# Altium schematic sheet LINK2_LPC4322 PERIPH-DEBUG.SchDoc
size A3; CheckedBy: José Ogando; Engineer: Eduardo Teofilo; Revision: A2; SheetNumber: 8; SheetTotal: 8
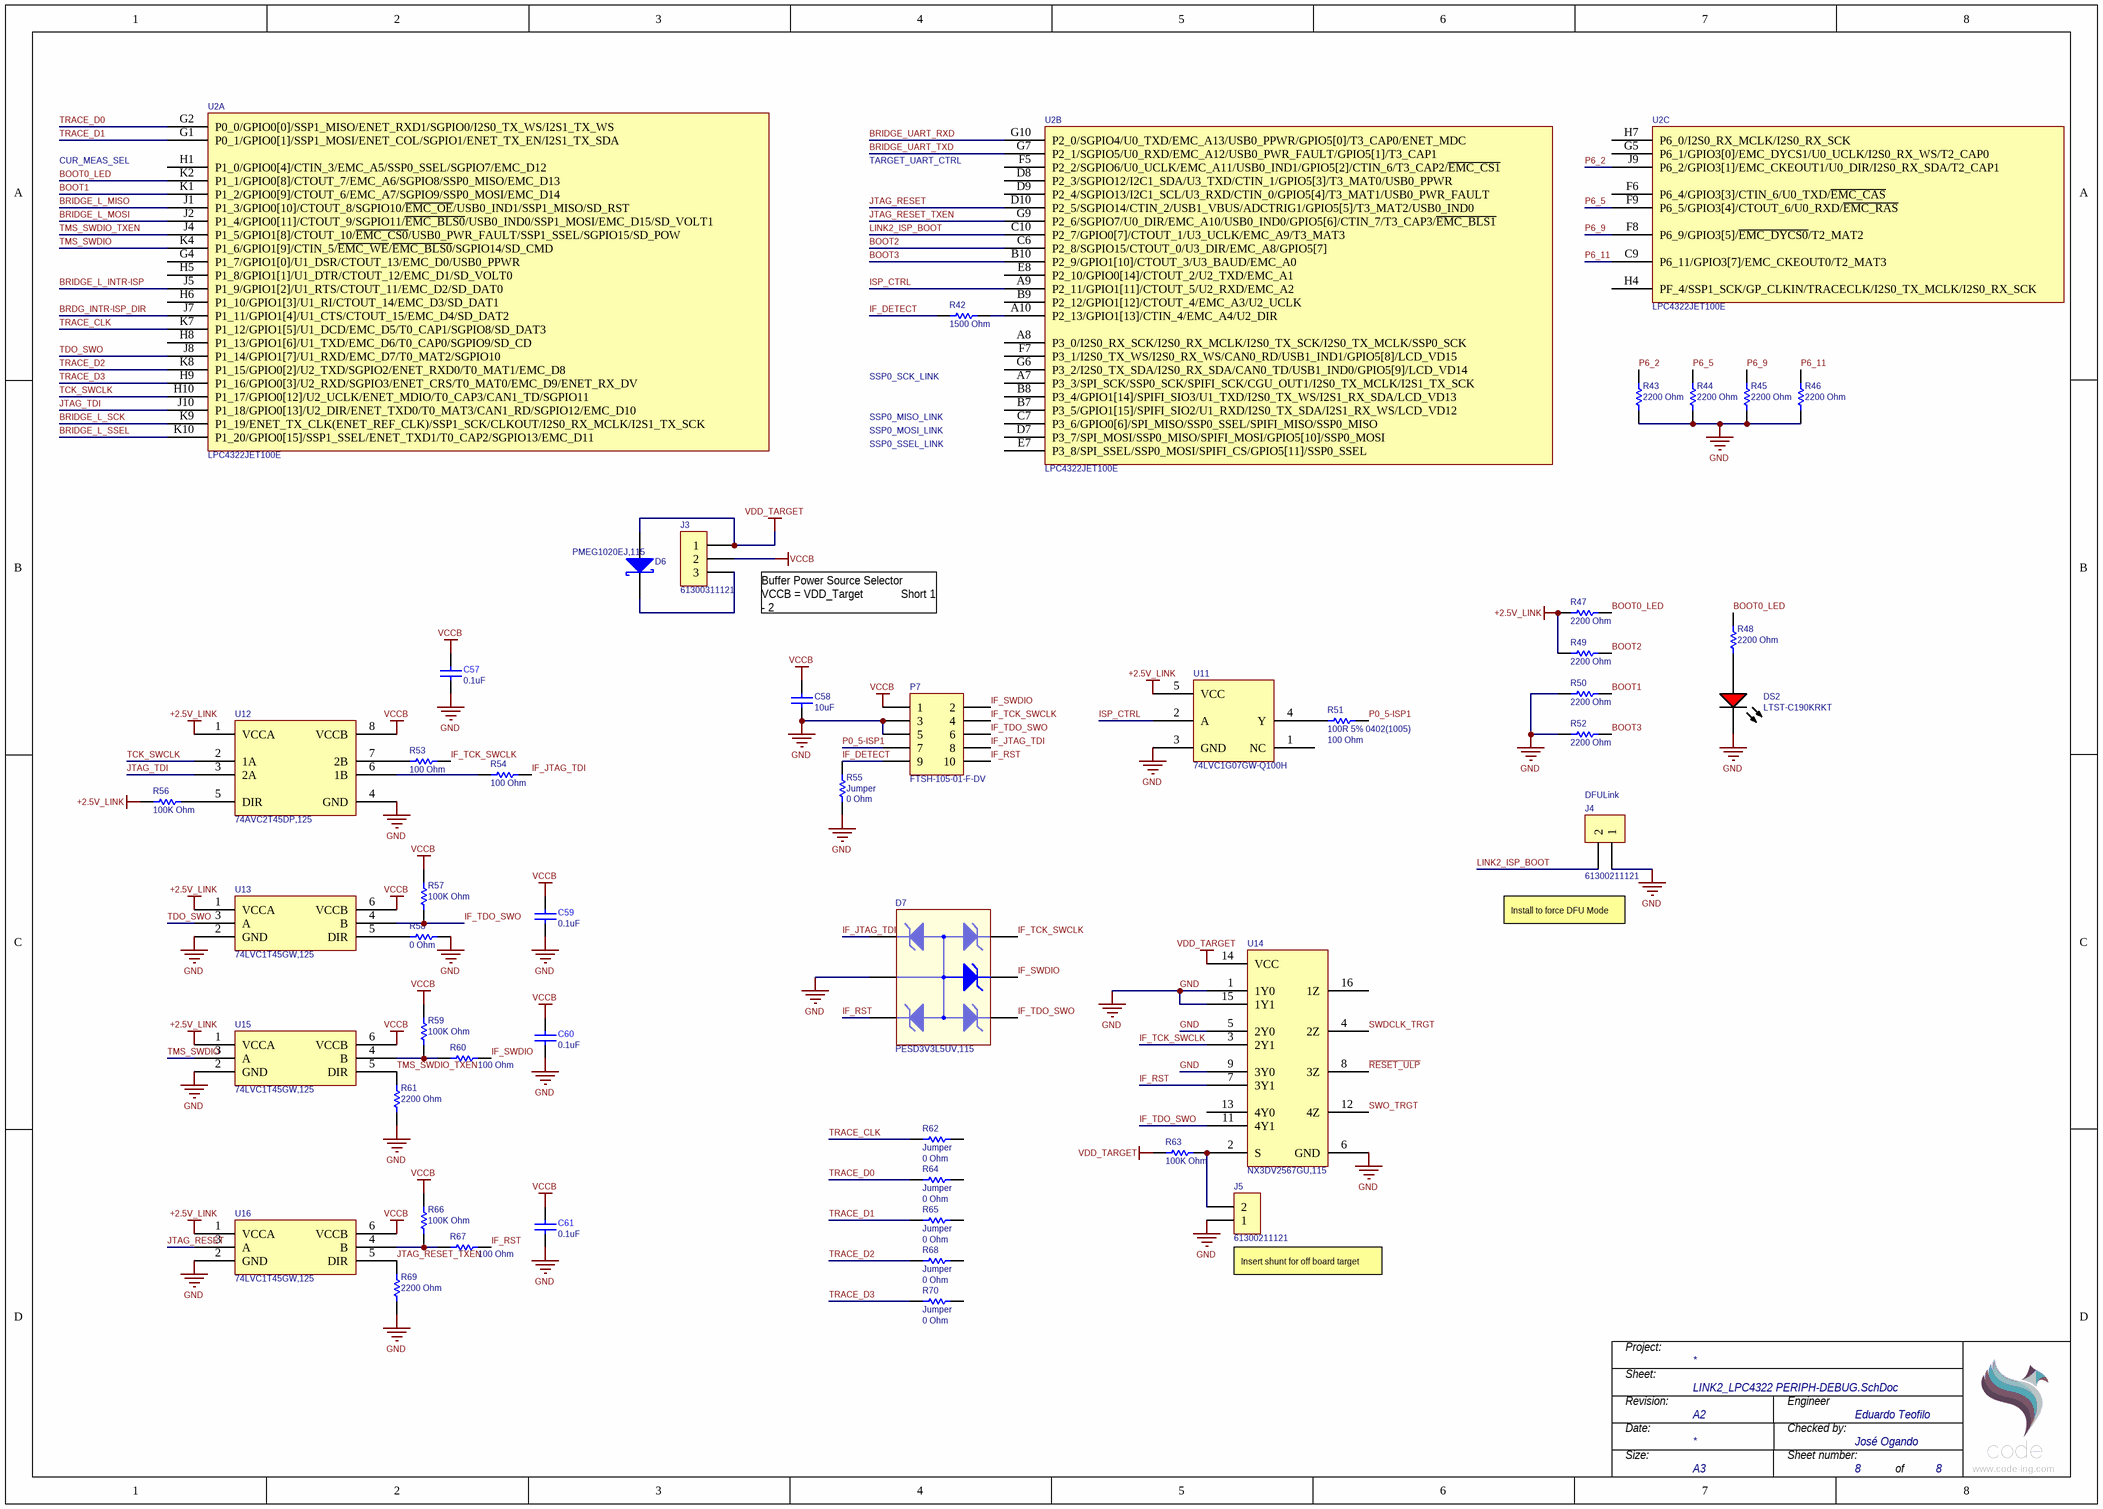
[diagram p0: LINK2_LPC4322 PERIPH-DEBUG.SchDoc]

## Parts
C57  value 0.1uF  [CAPC1005]  (hidden comment: CC0402KRX7R7BB104)
C58  value 10uF  [CAPC0805(2012)145_L]  (hidden comment: CAP 10uF 10V 0805(2012))
C59  value 0.1uF  [CAPC1005]  (hidden comment: CC0402KRX7R7BB104)
C60  value 0.1uF  [CAPC1005]  (hidden comment: CC0402KRX7R7BB104)
C61  value 0.1uF  [CAPC1005]  (hidden comment: CC0402KRX7R7BB104)
D6  PMEG1020EJ,115  [SOD-323F, SC90]
D7  PESD3V3L5UV,115  [SOT-666]
DS2  LTST-C190KRKT  [LTST-C191KRKT_V]
J3  61300311121  [61300311121]
J4  61300211121  [61300211121]
J5  61300211121  [61300211121]
P7  FTSH-105-01-F-DV  [FTSH-105-01-L-DV-K]
R42  value 1500 Ohm  [RESC0402(1005)_L]  (hidden comment: 1K5 1% 0402(1005))
R43  value 2200 Ohm  [RESC0402(1005)_L]  (hidden comment: 2K2 1% 0402(1005))
R44  value 2200 Ohm  [RESC0402(1005)_L]  (hidden comment: 2K2 1% 0402(1005))
R45  value 2200 Ohm  [RESC0402(1005)_L]  (hidden comment: 2K2 1% 0402(1005))
R46  value 2200 Ohm  [RESC0402(1005)_L]  (hidden comment: 2K2 1% 0402(1005))
R47  value 2200 Ohm  [RESC0402(1005)_L]  (hidden comment: 2K2 1% 0402(1005))
R48  value 2200 Ohm  [RESC0402(1005)_L]  (hidden comment: 2K2 1% 0402(1005))
R49  value 2200 Ohm  [RESC0402(1005)_L]  (hidden comment: 2K2 1% 0402(1005))
R50  value 2200 Ohm  [RESC0402(1005)_L]  (hidden comment: 2K2 1% 0402(1005))
R51  100R 5% 0402(1005)  value 100 Ohm  [RESC0402(1005)_L]
R52  value 2200 Ohm  [RESC0402(1005)_L]  (hidden comment: 2K2 1% 0402(1005))
R53  value 100 Ohm  [RESC0402(1005)_L]  (hidden comment: 100R 5% 0402(1005))
R54  value 100 Ohm  [RESC0402(1005)_L]  (hidden comment: 100R 5% 0402(1005))
R55  Jumper  value 0 Ohm  [RESC0402(1005)_L]
R56  value 100K Ohm  [RESC1005X40X25LL05T05]  (hidden comment: ERJ-2RKF1003X)
R57  value 100K Ohm  [RESC1005X40X25LL05T05]  (hidden comment: ERJ-2RKF1003X)
R58  value 0 Ohm  [RESC0402(1005)_L]  (hidden comment: Jumper 0402(1005))
R59  value 100K Ohm  [RESC1005X40X25LL05T05]  (hidden comment: ERJ-2RKF1003X)
R60  value 100 Ohm  [RESC0402(1005)_L]  (hidden comment: 100R 5% 0402(1005))
R61  value 2200 Ohm  [RESC0402(1005)_L]  (hidden comment: 2K2 1% 0402(1005))
R62  Jumper  value 0 Ohm  [RESC0402(1005)_L]
R63  value 100K Ohm  [RESC1005X40X25LL05T05]  (hidden comment: ERJ-2RKF1003X)
R64  Jumper  value 0 Ohm  [RESC0402(1005)_L]
R65  Jumper  value 0 Ohm  [RESC0402(1005)_L]
R66  value 100K Ohm  [RESC1005X40X25LL05T05]  (hidden comment: ERJ-2RKF1003X)
R67  value 100 Ohm  [RESC0402(1005)_L]  (hidden comment: 100R 5% 0402(1005))
R68  Jumper  value 0 Ohm  [RESC0402(1005)_L]
R69  value 2200 Ohm  [RESC0402(1005)_L]  (hidden comment: 2K2 1% 0402(1005))
R70  Jumper  value 0 Ohm  [RESC0402(1005)_L]
U2  LPC4322JET100E  [BGA100_9x9x1.2mm]  (parts A,B,C of 5)
U11  74LVC1G07GW-Q100H  [SOT353]
U12  74AVC2T45DP,125  [TSSOP8]
U13  74LVC1T45GW,125  [SOT-363]
U14  NX3DV2567GU,115  [XQFN16]
U15  74LVC1T45GW,125  [SOT-363]
U16  74LVC1T45GW,125  [SOT-363]

## Nets
+2.5V_LINK: R47.2 R49.2 R56.1 U11.5(VCC) U12.1(VCCA) U13.1(VCCA) U15.1(VCCA) U16.1(VCCA)
GND: C57.2 C58.1 C59.2 C60.2 C61.2 D7.2(GND) DS2.2(K) J4.1 J5.1 P7.3 P7.5 R43.1 R44.1 R45.1 R46.1 R50.2 R52.2 R55.1 R58.1 R61.1 R69.1 U11.3(GND) U12.4(GND) U13.2(GND) U14.1(1Y0) U14.5(2Y0) U14.6(GND) U14.9(3Y0) U14.15(1Y1) U15.2(GND) U16.2(GND)
VCCB: C57.1 C58.2 C59.1 C60.1 C61.1 J3.2 P7.1 R57.2 R59.2 R66.2 U12.8(VCCB) U13.6(VCCB) U15.6(VCCB) U16.6(VCCB)
VDD_TARGET: D6.2(A) J3.1 R63.2 U14.14(VCC)
BOOT0_LED: R47.1 R48.2 U2.K2(P1_1/GPIO0[8]/CTOUT_7/EMC_A6/SGPIO8/SSP0_MISO/EMC_D13)
BOOT1: R50.1 U2.K1(P1_2/GPIO0[9]/CTOUT_6/EMC_A7/SGPIO9/SSP0_MOSI/EMC_D14)
BOOT2: R49.1 U2.C6(P2_8/SGPIO15/CTOUT_0/U3_DIR/EMC_A8/GPIO5[7])
BOOT3: R52.1 U2.B10(P2_9/GPIO1[10]/CTOUT_3/U3_BAUD/EMC_A0)
BRDG_INTR-ISP_DIR: U2.J7(P1_11/GPIO1[4]/U1_CTS/CTOUT_15/EMC_D4/SD_DAT2)
BRIDGE_L_INTR-ISP: U2.J5(P1_9/GPIO1[2]/U1_RTS/CTOUT_11/EMC_D2/SD_DAT0)
BRIDGE_L_MISO: U2.J1(P1_3/GPIO0[10]/CTOUT_8/SGPIO10/~{EMC_OE}/USB0_IND1/SSP1_MISO/SD_RST)
BRIDGE_L_MOSI: U2.J2(P1_4/GPIO0[11]/CTOUT_9/SGPIO11/~{EMC_BLS0}/USB0_IND0/SSP1_MOSI/EMC_D15/SD_VOLT1)
BRIDGE_L_SCK: U2.K9(P1_19/ENET_TX_CLK(ENET_REF_CLK)/SSP1_SCK/CLKOUT/I2S0_RX_MCLK/I2S1_TX_SCK)
BRIDGE_L_SSEL: U2.K10(P1_20/GPIO0[15]/SSP1_SSEL/ENET_TXD1/T0_CAP2/SGPIO13/EMC_D11)
BRIDGE_UART_RXD: U2.G10(P2_0/SGPIO4/U0_TXD/EMC_A13/USB0_PPWR/GPIO5[0]/T3_CAP0/ENET_MDC)
BRIDGE_UART_TXD: U2.G7(P2_1/SGPIO5/U0_RXD/EMC_A12/USB0_PWR_FAULT/GPIO5[1]/T3_CAP1)
IF_DETECT: P7.9 R42.1 R55.2
IF_JTAG_TDI: D7.1(I/O1) P7.8 R54.2
IF_RST: D7.3(I/O2) P7.10 R67.2 U14.7(3Y1)
IF_SWDIO: D7.5(I/O4) P7.2 R60.2
IF_TCK_SWCLK: D7.6(I/O5) P7.4 R53.2 U14.3(2Y1)
IF_TDO_SWO: D7.4(I/O3) P7.6 R57.1 U13.4(B) U14.11(4Y1)
ISP_CTRL: U2.A9(P2_11/GPIO1[11]/CTOUT_5/U2_RXD/EMC_A2) U11.2(A)
JTAG_RESET: U2.D10(P2_5/SGPIO14/CTIN_2/USB1_VBUS/ADCTRIG1/GPIO5[5]/T3_MAT2/USB0_IND0) U16.3(A)
JTAG_RESET_TXEN: R69.2 U2.G9(P2_6/SGPIO7/U0_DIR/EMC_A10/USB0_IND0/GPIO5[6]/CTIN_7/T3_CAP3/~{EMC_BLS1}) U16.5(DIR)
JTAG_TDI: U2.J10(P1_18/GPIO0[13]/U2_DIR/ENET_TXD0/T0_MAT3/CAN1_RD/SGPIO12/EMC_D10) U12.3(2A)
LINK2_ISP_BOOT: J4.2 U2.C10(P2_7/GPIO0[7]/CTOUT_1/U3_UCLK/EMC_A9/T3_MAT3)
P0_5-ISP1: P7.7 R51.2
P6_2: R43.2 U2.J9(P6_2/GPIO3[1]/EMC_CKEOUT1/U0_DIR/I2S0_RX_SDA/T2_CAP1)
P6_5: R44.2 U2.F9(P6_5/GPIO3[4]/CTOUT_6/U0_RXD/~{EMC_RAS})
P6_9: R45.2 U2.F8(P6_9/GPIO3[5]/~{EMC_DYCS0}/T2_MAT2)
P6_11: R46.2 U2.C9(P6_11/GPIO3[7]/EMC_CKEOUT0/T2_MAT3)
~{RESET_ULP}: U14.8(3Z)
SWDCLK_TRGT: U14.4(2Z)
SWO_TRGT: U14.12(4Z)
TCK_SWCLK: U2.H10(P1_17/GPIO0[12]/U2_UCLK/ENET_MDIO/T0_CAP3/CAN1_TD/SGPIO11) U12.2(1A)
TDO_SWO: U2.J8(P1_14/GPIO1[7]/U1_RXD/EMC_D7/T0_MAT2/SGPIO10) U13.3(A)
TMS_SWDIO: U2.K4(P1_6/GPIO1[9]/CTIN_5/~{EMC_WE}/~{EMC_BLS0}/SGPIO14/SD_CMD) U15.3(A)
TMS_SWDIO_TXEN: R61.2 U2.J4(P1_5/GPIO1[8]/CTOUT_10/~{EMC_CS0}/USB0_PWR_FAULT/SSP1_SSEL/SGPIO15/SD_POW) U15.5(DIR)
TRACE_CLK: R62.1 U2.K7(P1_12/GPIO1[5]/U1_DCD/EMC_D5/T0_CAP1/SGPIO8/SD_DAT3)
TRACE_D0: R64.1 U2.G2(P0_0/GPIO0[0]/SSP1_MISO/ENET_RXD1/SGPIO0/I2S0_TX_WS/I2S1_TX_WS)
TRACE_D1: R65.1 U2.G1(P0_1/GPIO0[1]/SSP1_MOSI/ENET_COL/SGPIO1/ENET_TX_EN/I2S1_TX_SDA)
TRACE_D2: R68.1 U2.K8(P1_15/GPIO0[2]/U2_TXD/SGPIO2/ENET_RXD0/T0_MAT1/EMC_D8)
TRACE_D3: R70.1 U2.H9(P1_16/GPIO0[3]/U2_RXD/SGPIO3/ENET_CRS/T0_MAT0/EMC_D9/ENET_RX_DV)
NetD6_1: D6.1(K) J3.3
NetDS2_1: DS2.1(A) R48.1
NetJ5_2: J5.2 R63.1 U14.2(S)
NetR42_2: R42.2 U2.A10(P2_13/GPIO1[13]/CTIN_4/EMC_A4/U2_DIR)
NetR51_1: R51.1 U11.4(Y)
NetR53_1: R53.1 U12.7(2B)
NetR54_1: R54.1 U12.6(1B)
NetR56_2: R56.2 U12.5(DIR)
NetR58_2: R58.2 U13.5(DIR)
NetR59_1: R59.1 R60.1 U15.4(B)
NetR66_1: R66.1 R67.1 U16.4(B)

Not connected (* = marked no-connect by the designer): R62 2; R64 2; R65 2; R68 2; R70 2; U2 A7(P3_3/SPI_SCK/SSP0_SCK/SPIFI_SCK/CGU_OUT1/I2S0_TX_MCLK/I2S1_TX_SCK) A8(P3_0/I2S0_RX_SCK/I2S0_RX_MCLK/I2S0_TX_SCK/I2S0_TX_MCLK/SSP0_SCK) B7(P3_5/GPIO1[15]/SPIFI_SIO2/U1_RXD/I2S0_TX_SDA/I2S1_RX_WS/LCD_VD12) B8(P3_4/GPIO1[14]/SPIFI_SIO3/U1_TXD/I2S0_TX_WS/I2S1_RX_SDA/LCD_VD13) B9(P2_12/GPIO1[12]/CTOUT_4/EMC_A3/U2_UCLK) C7(P3_6/GPIO0[6]/SPI_MISO/SSP0_SSEL/SPIFI_MISO/SSP0_MISO) D7(P3_7/SPI_MOSI/SSP0_MISO/SPIFI_MOSI/GPIO5[10]/SSP0_MOSI) D8(P2_3/SGPIO12/I2C1_SDA/U3_TXD/CTIN_1/GPIO5[3]/T3_MAT0/USB0_PPWR) D9(P2_4/SGPIO13/I2C1_SCL/U3_RXD/CTIN_0/GPIO5[4]/T3_MAT1/USB0_PWR_FAULT) E7(P3_8/SPI_SSEL/SSP0_MOSI/SPIFI_CS/GPIO5[11]/SSP0_SSEL) E8(P2_10/GPIO0[14]/CTOUT_2/U2_TXD/EMC_A1) F5(P2_2/SGPIO6/U0_UCLK/EMC_A11/USB0_IND1/GPIO5[2]/CTIN_6/T3_CAP2/~{EMC_CS1}) F6(P6_4/GPIO3[3]/CTIN_6/U0_TXD/~{EMC_CAS}) F7(P3_1/I2S0_TX_WS/I2S0_RX_WS/CAN0_RD/USB1_IND1/GPIO5[8]/LCD_VD15) G4(P1_7/GPIO1[0]/U1_DSR/CTOUT_13/EMC_D0/USB0_PPWR) G5(P6_1/GPIO3[0]/EMC_DYCS1/U0_UCLK/I2S0_RX_WS/T2_CAP0) G6(P3_2/I2S0_TX_SDA/I2S0_RX_SDA/CAN0_TD/USB1_IND0/GPIO5[9]/LCD_VD14) H1(P1_0/GPIO0[4]/CTIN_3/EMC_A5/SSP0_SSEL/SGPIO7/EMC_D12) H4(PF_4/SSP1_SCK/GP_CLKIN/TRACECLK/I2S0_TX_MCLK/I2S0_RX_SCK) H5(P1_8/GPIO1[1]/U1_DTR/CTOUT_12/EMC_D1/SD_VOLT0) H6(P1_10/GPIO1[3]/U1_RI/CTOUT_14/EMC_D3/SD_DAT1) H7(P6_0/I2S0_RX_MCLK/I2S0_RX_SCK) H8(P1_13/GPIO1[6]/U1_TXD/EMC_D6/T0_CAP0/SGPIO9/SD_CD); U11 1(NC); U14 10(NC) 13(4Y0) 16(1Z)

## Notes on the sheet
- CUR_MEAS_SEL
- TARGET_UART_CTRL
- SSP0_SCK_LINK
- SSP0_MISO_LINK
- SSP0_MOSI_LINK
- SSP0_SSEL_LINK
- Buffer Power Source Selector
  VCCB = VDD_Target            Short 1 - 2
  VCCB = Off-board Target   Short 2 - 3
- DFULink
- Install to force DFU Mode
- (near J5) Insert shunt for off board target
- Project:
- Sheet:
- Revision:
- Date:
- Size:
- Sheet number:
- Engineer
- Checked by:
- A3
- of
- www.code-ing.com

## Library data of the parts
C57 C59-C61 = CMP-0001-00074-1: Capacitor, Yageo, Ceramic, 0.1uF 10% 16V 0402 (1005) X7R; Polarity: Non-Polarized; ClassName: Board Template Device; Rated Voltage: 16 V; Status: Production; Tolerance: 10 %; Mounting Technology: Surface Mount; Technology: Ceramic; Category: Capacitor; Dielectric: X7R; Publisher: Altium
C58 = CMP-1036-04922-1: CAP 10uF 10V ±10% 0805 (2012 Metric) Thickness 1.45mm SMD; Tolerance: Â±10%; Case-EIA: 0805; Case-Metric: 2012; Technology: SMT; Rated Voltage: 10 V; Max Thickness: 1.45 mm
D6 = PMEG1020EJ,115: DIODE SCHOTTKY 10V 2A SOD323F; Manufacturer: Nexperia USA Inc.; Manufacturer part #: PMEG1020EJ,115; Created by: eteofilo; Creation Date: 12-Apr-2018; Modified by: *; Value: *; Indications: *
D7 = PESD3V3L5UV,115: TVS DIODE 3.3V 12V SOT666; Manufacturer: Nexperia USA Inc.; Manufacturer part #: PESD3V3L5UV,115; Indications: *; Modified by: *; Created by: eteofilo; Creation date: 12-Apr-2018; Value: *
DS2 = CMP-1674-00011-1: LED Uni-Color Red, 62.5 mW, 5 V, -30 to 85 degC, 2-Pin SMD, RoHS, Tape and Reel; Capacitance: 100 uF; Voltage Rating: 50 V; Case\Package: Radial; Tolerance: 20%; Packaging: Bulk; REACH SVHC: No SVHC; ComponentLink1Description: Manufacturer URL; ComponentLink2URL: http://optoelectronics.liteon.com/upload/download/DS-22-99-0151/S_110_LTST-C190KRKT.pdf; Max Operating Temperature: 85 degC; DatasheetVersion: Rev. F, 05/2013; Pins: 2; Voltage Rating (DC): 50 V; Mount: Through Hole; Lead Pitch: 3.5 mm; Diameter: 8 mm; ComponentLink1URL: http://www.us.liteon.com/; Radiation Hardening: No; Package Quantity: 200; PackageReference: C191KRKT; RoHSCompliant: true; Height: 11.5 mm; PackageDescription: 2-Pin Surface Mount Device, Body 1.6 x 0.8 mm; Length: 11.5 mm; ComponentLink2Description: Datasheet; Min Operating Temperature: -40 degC
J3 = 61300311121: HEADER 3POS SNGL T/H 2.54MM; Manufacturer: Wurth Electronics Inc; Manufacturer part #: 61300311121; DigiKey: *; Modified by: *; Value: *; Created by: gmoreno; Creation date: 28-Jul-2012
J4 = 61300211121: HEADER 2POS SNGL T/H 2.54MM; Manufacturer: Wurth Electronics Inc; Manufacturer part #: 61300211121; Modified by: *; Value: *; Created by: gmoreno; Creation date: 28-Jul-2012
J5 = 61300211121: HEADER 2POS SNGL T/H 2.54MM; Manufacturer: Wurth Electronics Inc; Indications: DNI; Manufacturer part #: 61300211121; Modified by: *; Value: *; Created by: gmoreno; Creation date: 28-Jul-2012
P7 = FTSH-105-01-F-DV: CONN HEADER 10POS DUAL .05" SMD; Manufacturer: Samtec Inc; Manufacturer part #: FTSH-105-01-F-DV; Indications: *; Created by: gmoreno; Creation date: 29-Jul-2013; Value: *; Modified by: *
R42 = CMP-1011-00528-1: 1K5 0.063W 1% 0402 (1005 Metric)  SMD; Case-Metric: 1005; Case-EIA: 0402; Tolerance: 1 %; Power: 0.063 W; Technology: SMT
R43-R45 = CMP-1011-00546-1: 2K2 0.063W 1% 0402 (1005 Metric)  SMD; Case-Metric: 1005; Case-EIA: 0402; Indications: DNI; Power: 0.063 W; Tolerance: 1 %; Technology: SMT
R46-R50 R52 R61 R69 = CMP-1011-00546-1: 2K2 0.063W 1% 0402 (1005 Metric)  SMD; Case-Metric: 1005; Case-EIA: 0402; Power: 0.063 W; Tolerance: 1 %; Technology: SMT
R51 R53 R54 R60 R67 = CMP-1011-00050-1: 100R 0.063W 5% 0402 (1005 Metric)  SMD; Case-Metric: 1005; Case-EIA: 0402; Power: 0.063 W; Technology: SMT; Tolerance: 5 %
R55 R58 = CMP-1011-00001-1: Jumper 0402 (1005 Metric); Tolerance: None; Case-Metric: 1005; Case-EIA: 0402; Power: None; Technology: SMT
R56 R57 R59 R63 R66 = CMP-2002-00608-3: Chip Resistor, 100 KOhm, +/- 1%, 100 mW, -55 to 155 degC, 0402 (1005 Metric), RoHS, Tape and Reel; Manufacturer: Basic Passives; Power Rating: 100 mW; Voltage Rating: 50 V; Case\/Package: 0402; Case Code (Imperial): 0402; RoHSCompliant: true; Min Operating Temperature: -55 degC; Mount: Surface Mount; Packaging: Tape and Reel; PackageDescription: 2-Pin Surface Mount Device, Body 1 x 0.5 mm; Tolerance: 1%; REACH SVHC: Yes; ComponentLink1URL: http://www.panasonic.com/; ComponentLink1Description: Manufacturer URL; Package Quantity: 10000; Mounting Technology: Surface Mount; DatasheetVersion: 04/2015; PartNumber: ERJ-2RKF1003X; Height: 0.35 mm; Pins: 2; Length: 1 mm; Max Operating Temperature: 155 degC; ComponentLink2Description: Datasheet; ComponentLink2URL: http://industrial.panasonic.com/cdbs/www-data/pdf/RDA0000/AOA0000C86.pdf; PackageReference: 0402; Radiation Hardening: No; Width: 0.5 mm; Case Code (Metric): 1005
R62 R64 R65 R68 R70 = CMP-1011-00001-1: Jumper 0402 (1005 Metric); Tolerance: None; Case-Metric: 1005; Case-EIA: 0402; Indications: DNI; Power: None; Technology: SMT
U2 = LPC4322JET100E: IC MCU 32BIT 512KB FLASH 100BGA; Manufacturer: NXP; Manufacturer Part #: LPC4322JET100E; Created by: eteofilo; Creation Date: 09-Apr-2018; Modified by: *; Indications: *; Value: *
U11 = 74LVC1G07GW-Q100H: IC BUFF OPEN DRAIN N-INV 5TSSOP; Manufacturer: Nexperia USA Inc.; Manufacturer part #: 74LVC1G07GW-Q100H; Indications: *; Modified by: *; Created by: eteofilo; Creation date: 12-Apr-2018; Value: *
U12 = 74AVC2T45DP,125: IC BUS TRANSCVR TRI-ST DL 8TSSOP; Manufacturer: Nexperia USA Inc.; Created By: eteofilo; Creation Date: 11-Apr-2018; Modified by: *; Indications: *; Value: *; Manufacturer Part #: 74AVC2T45DP,125
U13 U15 U16 = 74LVC1T45GW,125: TXRX XLATING DUAL 3ST 6TSSOP; Manufacturer: Nexperia USA Inc.; Created By: eteofilo; Creation Date: 12-Apr-2018; Modified by: *; Indications: *; Value: *; Manufacturer Part #: 74LVC1T45GW,125
U14 = NX3DV2567GU,115: IC ANLG SWITCH 4PDT 16XQFN; Manufacturer: NXP USA Inc.; Manufacturer part #: NX3DV2567GU,115; Indications: *; Modified by: *; Creation date: 14-Apr-2018; Created by: eteofilo; Value: *